# Altium project NXP_RESET_BOARD_V2.PrjPcb
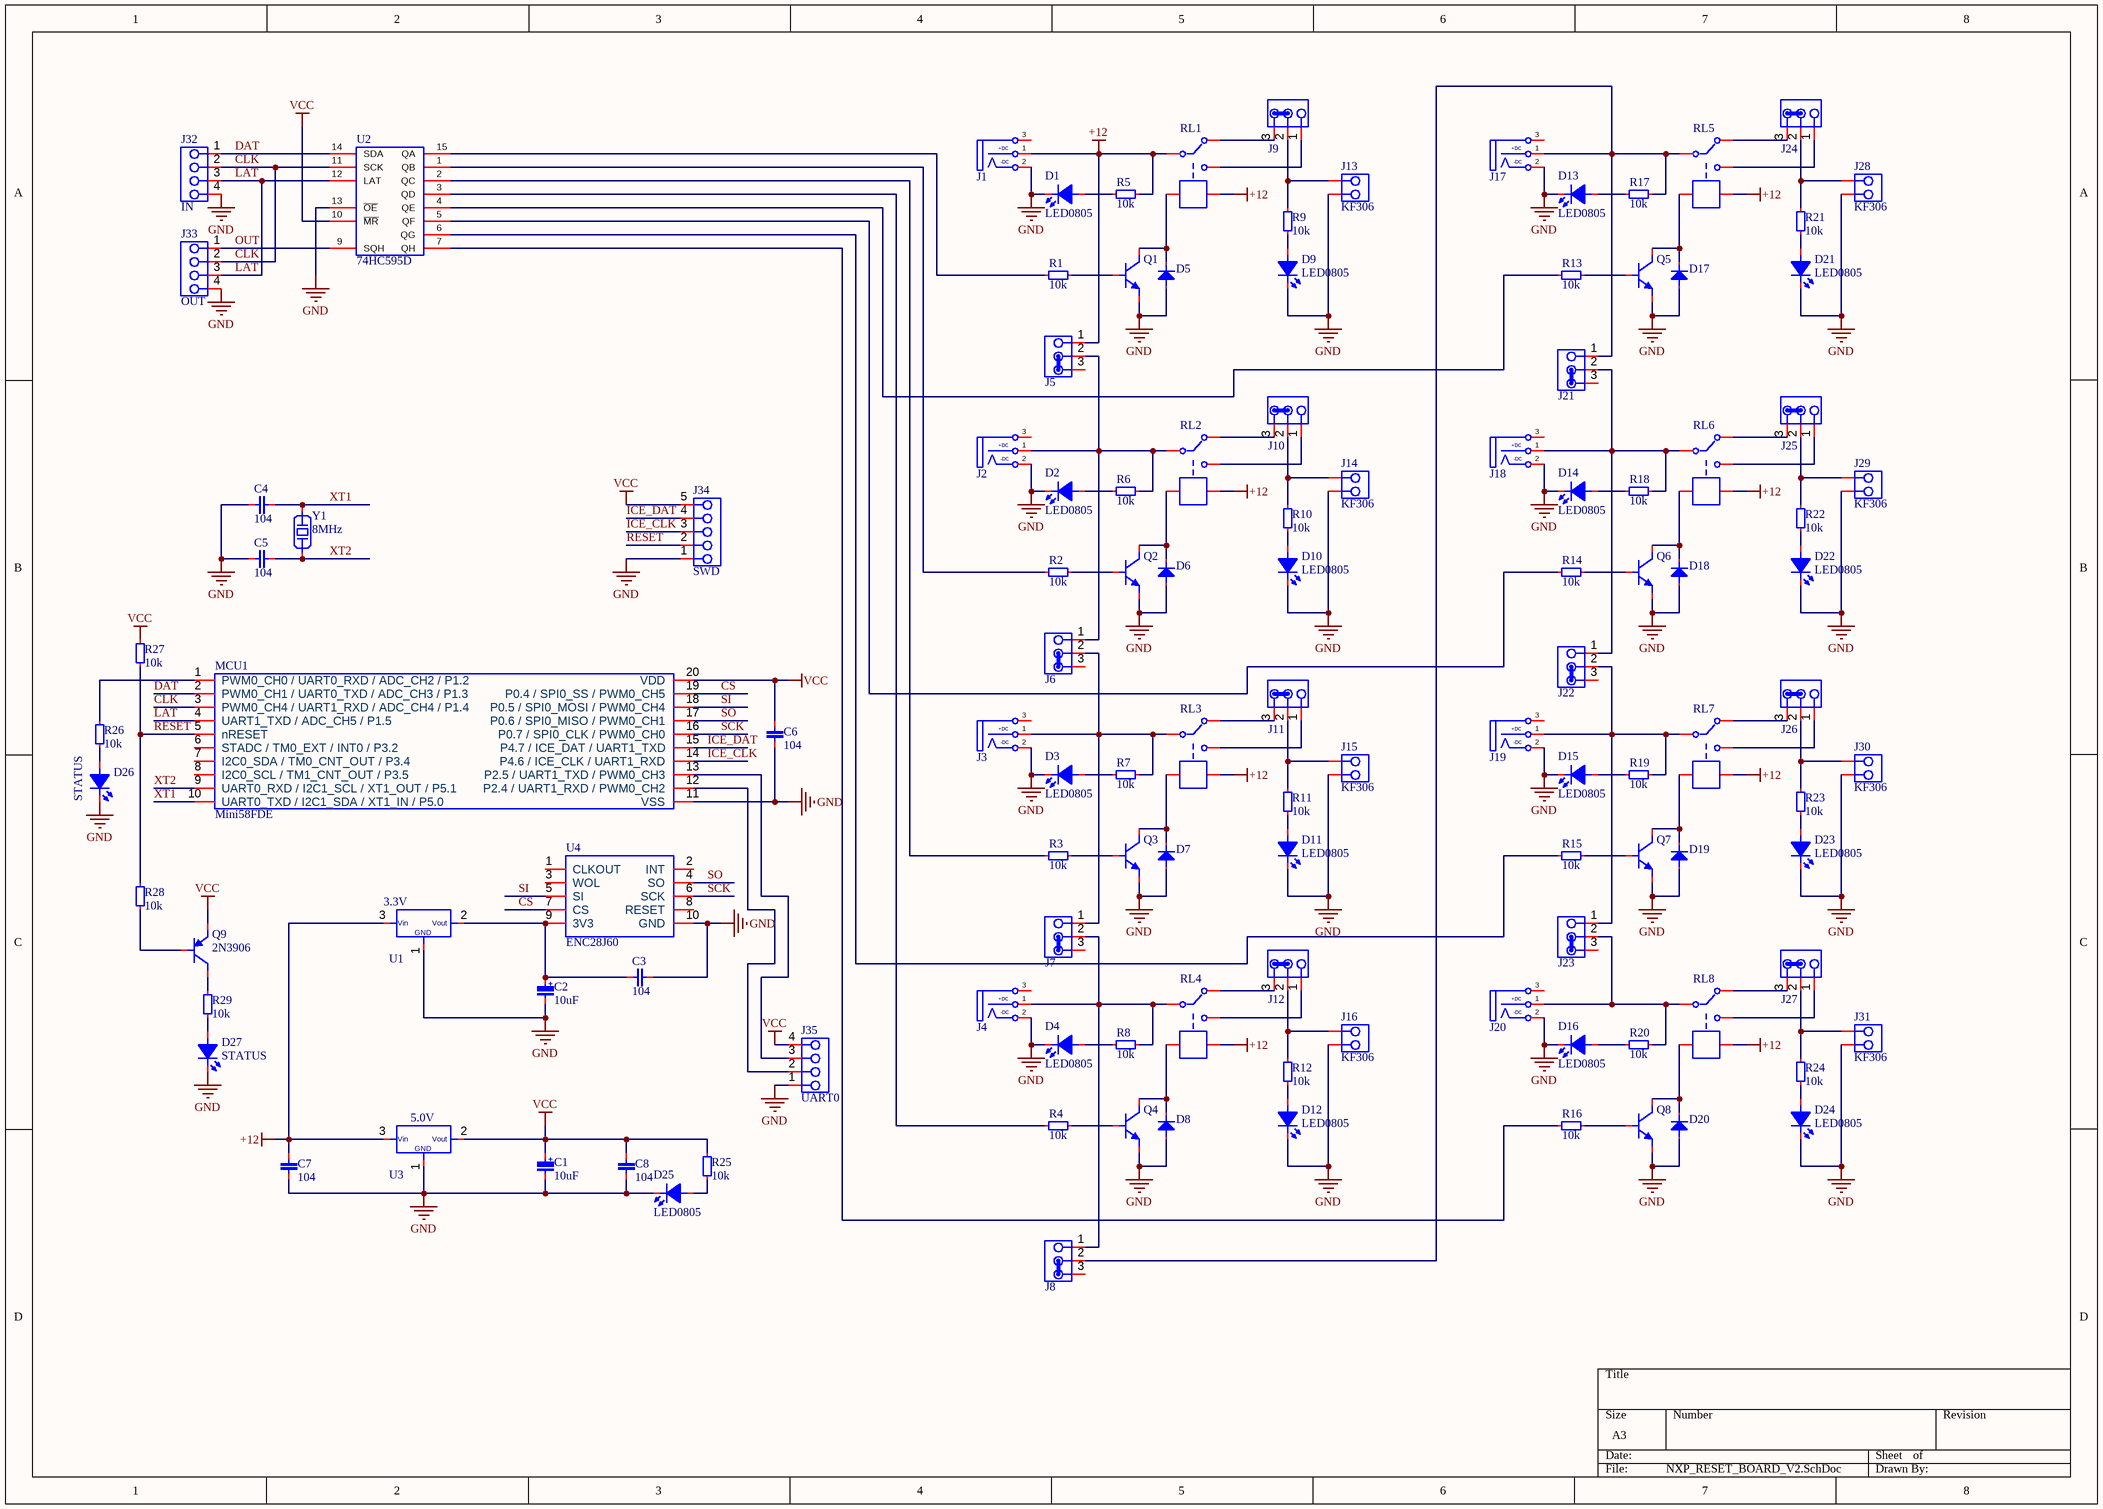
[diagram p0: NXP_RESET_BOARD_V2.SchDoc]
1 sheet, 122 parts. Net scope: global (net labels, ports and power ports of the same name join across sheets).
Board files: NXP_RESET_BOARD_V2.PcbDoc, ExternalModule.PcbDoc

## Sheet NXP_RESET_BOARD_V2.SchDoc
size A3; SheetNumber: 1; SheetTotal: 1

### Parts
C1  10uF  [CAP_RAD_D05x11]
C2  10uF  [CAP_RAD_D05x11]
C3  104  [C0805]
C4  104  [C0805]
C5  104  [C0805]
C6  104  [C0805]
C7  104  [C0805]
C8  104  [C0805]
D1  LED0805  [L0805RED]
D2  LED0805  [L0805RED]
D3  LED0805  [L0805RED]
D4  LED0805  [L0805RED]
D5  1N4148  [SOD-80]  (value not drawn)
D6  1N4148  [SOD-80]  (value not drawn)
D7  1N4148  [SOD-80]  (value not drawn)
D8  1N4148  [SOD-80]  (value not drawn)
D9  LED0805  [L0805RED]
D10  LED0805  [L0805RED]
D11  LED0805  [L0805RED]
D12  LED0805  [L0805RED]
D13  LED0805  [L0805RED]
D14  LED0805  [L0805RED]
D15  LED0805  [L0805RED]
D16  LED0805  [L0805RED]
D17  1N4148  [SOD-80]  (value not drawn)
D18  1N4148  [SOD-80]  (value not drawn)
D19  1N4148  [SOD-80]  (value not drawn)
D20  1N4148  [SOD-80]  (value not drawn)
D21  LED0805  [L0805RED]
D22  LED0805  [L0805RED]
D23  LED0805  [L0805RED]
D24  LED0805  [L0805RED]
D25  LED0805  [L0805RED]
D26  STATUS  [L0805RED]
D27  STATUS  [L0805RED]
J1  Connector  [DC_K375A_Power]  (value not drawn)
J2  Connector  [DC_K375A_Power]  (value not drawn)
J3  Connector  [DC_K375A_Power]  (value not drawn)
J4  Connector  [DC_K375A_Power]  (value not drawn)
J5  HEADER-MALE-2.54MM  [HEADER-MALE-03PINS-2.54MM]  (value not drawn)
J6  HEADER-MALE-2.54MM  [HEADER-MALE-03PINS-2.54MM]  (value not drawn)
J7  HEADER-MALE-2.54MM  [HEADER-MALE-03PINS-2.54MM]  (value not drawn)
J8  HEADER-MALE-2.54MM  [HEADER-MALE-03PINS-2.54MM]  (value not drawn)
J9  HEADER-MALE-2.54MM  [HEADER-MALE-03PINS-2.54MM]  (value not drawn)
J10  HEADER-MALE-2.54MM  [HEADER-MALE-03PINS-2.54MM]  (value not drawn)
J11  HEADER-MALE-2.54MM  [HEADER-MALE-03PINS-2.54MM]  (value not drawn)
J12  HEADER-MALE-2.54MM  [HEADER-MALE-03PINS-2.54MM]  (value not drawn)
J13  KF306  [DG306-5.0-02P-12-00AH]
J14  KF306  [DG306-5.0-02P-12-00AH]
J15  KF306  [DG306-5.0-02P-12-00AH]
J16  KF306  [DG306-5.0-02P-12-00AH]
J17  Connector  [DC_K375A_Power]  (value not drawn)
J18  Connector  [DC_K375A_Power]  (value not drawn)
J19  Connector  [DC_K375A_Power]  (value not drawn)
J20  Connector  [DC_K375A_Power]  (value not drawn)
J21  HEADER-MALE-2.54MM  [HEADER-MALE-03PINS-2.54MM]  (value not drawn)
J22  HEADER-MALE-2.54MM  [HEADER-MALE-03PINS-2.54MM]  (value not drawn)
J23  HEADER-MALE-2.54MM  [HEADER-MALE-03PINS-2.54MM]  (value not drawn)
J24  HEADER-MALE-2.54MM  [HEADER-MALE-03PINS-2.54MM]  (value not drawn)
J25  HEADER-MALE-2.54MM  [HEADER-MALE-03PINS-2.54MM]  (value not drawn)
J26  HEADER-MALE-2.54MM  [HEADER-MALE-03PINS-2.54MM]  (value not drawn)
J27  HEADER-MALE-2.54MM  [HEADER-MALE-03PINS-2.54MM]  (value not drawn)
J28  KF306  [DG306-5.0-02P-12-00AH]
J29  KF306  [DG306-5.0-02P-12-00AH]
J30  KF306  [DG306-5.0-02P-12-00AH]
J31  KF306  [DG306-5.0-02P-12-00AH]
J32  IN  [HEADER-MALE-04PINS-2.54MM]
J33  OUT  [HEADER-MALE-04PINS-2.54MM]
J34  SWD  [HEADER-MALE-05PINS-2.54MM]
J35  UART0  [HEADER-MALE-04PINS-2.54MM]
MCU1  Mini58FDE  [TSSOP20_0.65_4.4]
Q1  2N3904  [SOT23-3]  (value not drawn)
Q2  2N3904  [SOT23-3]  (value not drawn)
Q3  2N3904  [SOT23-3]  (value not drawn)
Q4  2N3904  [SOT23-3]  (value not drawn)
Q5  2N3904  [SOT23-3]  (value not drawn)
Q6  2N3904  [SOT23-3]  (value not drawn)
Q7  2N3904  [SOT23-3]  (value not drawn)
Q8  2N3904  [SOT23-3]  (value not drawn)
Q9  2N3906  [SOT23-3]
R1  10k  [R0805]
R2  10k  [R0805]
R3  10k  [R0805]
R4  10k  [R0805]
R5  10k  [R0805]
R6  10k  [R0805]
R7  10k  [R0805]
R8  10k  [R0805]
R9  10k  [R0805]
R10  10k  [R0805]
R11  10k  [R0805]
R12  10k  [R0805]
R13  10k  [R0805]
R14  10k  [R0805]
R15  10k  [R0805]
R16  10k  [R0805]
R17  10k  [R0805]
R18  10k  [R0805]
R19  10k  [R0805]
R20  10k  [R0805]
R21  10k  [R0805]
R22  10k  [R0805]
R23  10k  [R0805]
R24  10k  [R0805]
R25  10k  [R0805]
R26  10k  [R0805]
R27  10k  [R0805]
R28  10k  [R0805]
R29  10k  [R0805]
RL1  Relay-SONGLE-SRD-05VDC  [RELAY-SONGLE-SRD-05VDC_BLUE]  (value not drawn)
RL2  Relay-SONGLE-SRD-05VDC  [RELAY-SONGLE-SRD-05VDC_BLUE]  (value not drawn)
RL3  Relay-SONGLE-SRD-05VDC  [RELAY-SONGLE-SRD-05VDC_BLUE]  (value not drawn)
RL4  Relay-SONGLE-SRD-05VDC  [RELAY-SONGLE-SRD-05VDC_BLUE]  (value not drawn)
RL5  Relay-SONGLE-SRD-05VDC  [RELAY-SONGLE-SRD-05VDC_BLUE]  (value not drawn)
RL6  Relay-SONGLE-SRD-05VDC  [RELAY-SONGLE-SRD-05VDC_BLUE]  (value not drawn)
RL7  Relay-SONGLE-SRD-05VDC  [RELAY-SONGLE-SRD-05VDC_BLUE]  (value not drawn)
RL8  Relay-SONGLE-SRD-05VDC  [RELAY-SONGLE-SRD-05VDC_BLUE]  (value not drawn)
U1  3.3V  [SOT223-3]
U2  74HC595D  [SO16]
U3  5.0V  [SOT223-3]
U4  ENC28J60  [ENC28J60]
Y1  8MHz  [SMD5032]

### Nets
+12: C7.1 J1.1(DS+) J5.1 R5.2 RL1.2 RL1.3 RL2.3 RL3.3 RL4.3 RL5.3 RL6.3 RL7.3 RL8.3 U1.3 U3.3
GND: C1.2 C2.2 C3.1 C4.2 C5.2 C6.2 C7.2 C8.2 D1.2(K) D2.2(K) D3.2(K) D4.2(K) D5.1 D6.1 D7.1 D8.1 D9.2(K) D10.2(K) D11.2(K) D12.2(K) D13.2(K) D14.2(K) D15.2(K) D16.2(K) D17.1 D18.1 D19.1 D20.1 D21.2(K) D22.2(K) D23.2(K) D24.2(K) D25.2(K) D26.2(K) D27.2(K) J1.2(DC-) J2.2(DC-) J3.2(DC-) J4.2(DC-) J13.1 J14.1 J15.1 J16.1 J17.2(DC-) J18.2(DC-) J19.2(DC-) J20.2(DC-) J28.1 J29.1 J30.1 J31.1 J32.4 J33.4 J34.1 J35.1 MCU1.11(VSS) Q1.2(E) Q2.2(E) Q3.2(E) Q4.2(E) Q5.2(E) Q6.2(E) Q7.2(E) Q8.2(E) U1.1 U2.8 U2.13(~{OE}) U3.1 U4.10(GND)
VCC: C1.1 C6.1 C8.1 J34.5 J35.4 MCU1.20(VDD) Q9.2(E) R25.2 R27.1 U2.10(~{MR}) U2.16 U3.2
CLK: J32.2 J33.2 MCU1.3(PWM0_CH4_/_UART1_RXD_/_ADC_CH4_/_P1.4) U2.11(SCK)
CS: MCU1.19(P0.4_/_SPI0_SS_/_PWM0_CH5) U4.7(CS)
DAT: J32.1 MCU1.2(PWM0_CH1_/_UART0_TXD_/_ADC_CH3_/_P1.3) U2.14(SDA)
ICE_CLK: J34.3 MCU1.14(P4.6_/_ICE_CLK_/_UART1_RXD)
ICE_DAT: J34.4 MCU1.15(P4.7_/_ICE_DAT_/_UART1_TXD)
LAT: J32.3 J33.3 MCU1.4(UART1_TXD_/_ADC_CH5_/_P1.5) U2.12(LAT)
OUT: J33.1 U2.9(SQH)
RESET: J34.2 MCU1.5(nRESET) R27.2 R28.1
SCK: MCU1.16(P0.7_/_SPI0_CLK_/_PWM0_CH0) U4.6(SCK)
SI: MCU1.18(P0.5_/_SPI0_MOSI_/_PWM0_CH4) U4.5(SI)
SO: MCU1.17(P0.6_/_SPI0_MISO_/_PWM0_CH1) U4.4(SO)
XT1: C4.1 MCU1.10(UART0_TXD_/_I2C1_SDA_/_XT1_IN_/_P5.0) Y1.1
XT2: C5.1 MCU1.9(UART0_RXD_/_I2C1_SCL_/_XT1_OUT_/_P5.1) Y1.2
NetC2_1: C2.1 C3.2 U1.2 U4.9(3V3)
NetD1_1: D1.1(A) R5.1
NetD2_1: D2.1(A) R6.1
NetD3_1: D3.1(A) R7.1
NetD4_1: D4.1(A) R8.1
NetD5_2: D5.2 Q1.3(C) RL1.1
NetD6_2: D6.2 Q2.3(C) RL2.1
NetD7_2: D7.2 Q3.3(C) RL3.1
NetD8_2: D8.2 Q4.3(C) RL4.1
NetD9_1: D9.1(A) R9.1
NetD10_1: D10.1(A) R10.1
NetD11_1: D11.1(A) R11.1
NetD12_1: D12.1(A) R12.1
NetD13_1: D13.1(A) R17.1
NetD14_1: D14.1(A) R18.1
NetD15_1: D15.1(A) R19.1
NetD16_1: D16.1(A) R20.1
NetD17_2: D17.2 Q5.3(C) RL5.1
NetD18_2: D18.2 Q6.3(C) RL6.1
NetD19_2: D19.2 Q7.3(C) RL7.1
NetD20_2: D20.2 Q8.3(C) RL8.1
NetD21_1: D21.1(A) R21.1
NetD22_1: D22.1(A) R22.1
NetD23_1: D23.1(A) R23.1
NetD24_1: D24.1(A) R24.1
NetD25_1: D25.1(A) R25.1
NetD26_1: D26.1(A) R26.2
NetD27_1: D27.1(A) R29.2
NetJ2_1: J2.1(DS+) J5.2 J6.1 R6.2 RL2.2
NetJ3_1: J3.1(DS+) J6.2 J7.1 R7.2 RL3.2
NetJ4_1: J4.1(DS+) J7.2 J8.1 R8.2 RL4.2
NetJ8_2: J8.2 J17.1(DS+) J21.1 R17.2 RL5.2
NetJ9_1: J9.1 RL1.4
NetJ9_2: J9.2 J13.2 R9.2
NetJ9_3: J9.3 RL1.5
NetJ10_1: J10.1 RL2.4
NetJ10_2: J10.2 J14.2 R10.2
NetJ10_3: J10.3 RL2.5
NetJ11_1: J11.1 RL3.4
NetJ11_2: J11.2 J15.2 R11.2
NetJ11_3: J11.3 RL3.5
NetJ12_1: J12.1 RL4.4
NetJ12_2: J12.2 J16.2 R12.2
NetJ12_3: J12.3 RL4.5
NetJ18_1: J18.1(DS+) J21.2 J22.1 R18.2 RL6.2
NetJ19_1: J19.1(DS+) J22.2 J23.1 R19.2 RL7.2
NetJ20_1: J20.1(DS+) J23.2 R20.2 RL8.2
NetJ24_1: J24.1 RL5.4
NetJ24_2: J24.2 J28.2 R21.2
NetJ24_3: J24.3 RL5.5
NetJ25_1: J25.1 RL6.4
NetJ25_2: J25.2 J29.2 R22.2
NetJ25_3: J25.3 RL6.5
NetJ26_1: J26.1 RL7.4
NetJ26_2: J26.2 J30.2 R23.2
NetJ26_3: J26.3 RL7.5
NetJ27_1: J27.1 RL8.4
NetJ27_2: J27.2 J31.2 R24.2
NetJ27_3: J27.3 RL8.5
NetJ35_2: J35.2 MCU1.12(P2.4_/_UART1_RXD_/_PWM0_CH2)
NetJ35_3: J35.3 MCU1.13(P2.5_/_UART1_TXD_/_PWM0_CH3)
NetMCU1_1: MCU1.1(PWM0_CH0_/_UART0_RXD_/_ADC_CH2_/_P1.2) R26.1
NetQ1_1: Q1.1(B) R1.2
NetQ2_1: Q2.1(B) R2.2
NetQ3_1: Q3.1(B) R3.2
NetQ4_1: Q4.1(B) R4.2
NetQ5_1: Q5.1(B) R13.2
NetQ6_1: Q6.1(B) R14.2
NetQ7_1: Q7.1(B) R15.2
NetQ8_1: Q8.1(B) R16.2
NetQ9_1: Q9.1(B) R28.2
NetQ9_3: Q9.3(C) R29.1
NetR1_1: R1.1 U2.15(QA)
NetR2_1: R2.1 U2.1(QB)
NetR3_1: R3.1 U2.2(QC)
NetR4_1: R4.1 U2.3(QD)
NetR13_1: R13.1 U2.4(QE)
NetR14_1: R14.1 U2.5(QF)
NetR15_1: R15.1 U2.6(QG)
NetR16_1: R16.1 U2.7(QH)

Not connected (* = marked no-connect by the designer): J1 3(T); J2 3(T); J3 3(T); J4 3(T); J5 3; J6 3; J7 3; J8 3; J17 3(T); J18 3(T); J19 3(T); J20 3(T); J21 3; J22 3; J23 3; MCU1 6(STADC_/_TM0_EXT_/_INT0_/_P3.2) 7(I2C0_SDA_/_TM0_CNT_OUT_/_P3.4) 8(I2C0_SCL_/_TM1_CNT_OUT_/_P3.5); U4 1(CLKOUT) 2(INT) 3(WOL) 8(RESET)

### Notes on the sheet
- (in symbol Capacitor(Radian)) +
- (in symbol Ic-AMS1117(SOT-223)) Vin; Vout; GND
- (in symbol JackDC) +DC; -DC

### Library data of the parts
C1 C2 = Capacitor(Radian)
C3-C8 = Capacitors(SMD)
D5-D8 D17-D20 = Diode-1N4148: The fast switching diode
D26 D27 = LED0805
J1-J4 J17-J20 = JackDC
J5-J12 J21-J27 = HEADER-MALE-03PINS-2.54MM
J13-J16 J28-J31 = DG306-5.0-02P-12-00AH
J32 J33 J35 = HEADER-MALE-04PINS-2.54MM
J34 = HEADER-MALE-05PINS-2.54MM
MCU1 = Mcu-Mini58FDE: Novoton 4Kb-RAM 32Kb-Flash
Q1-Q8 = Transistor-2N3904
Q9 = Transistor-2N3906
R1-R29 = Resistors-SMD
U1 U3 = Ic-AMS1117(SOT-223)
U2 = Ic-74HC595D
Y1 = Crystal